# Altium schematic sheet Overview and Power.SchDoc
size A; SheetNumber: 1; SheetTotal: 9
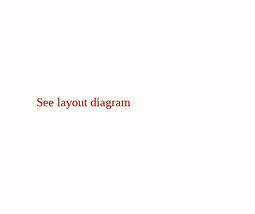
[diagram p0: Overview and Power.SchDoc, left]
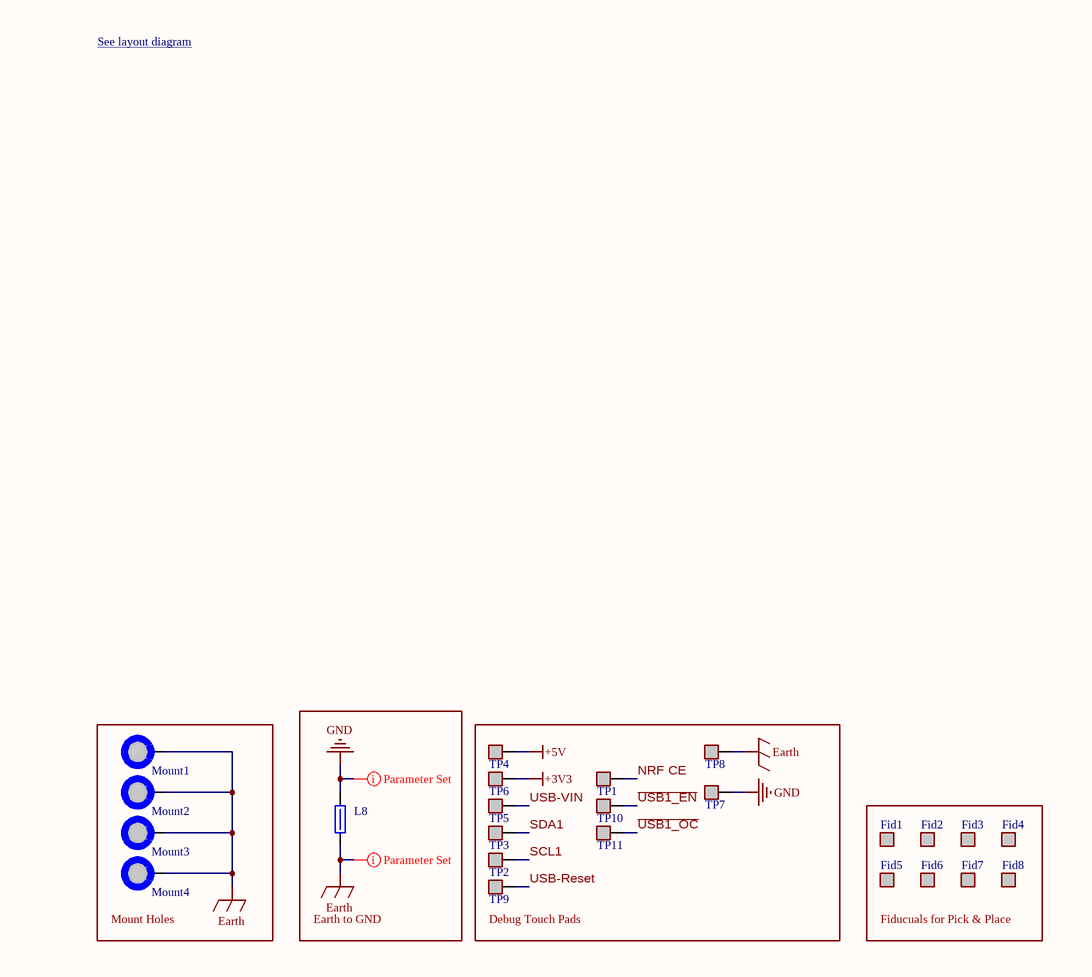
[diagram p1: Overview and Power.SchDoc, right]

## Parts
Fid1  JLCPCB Pick & Place Fiducial  [[Fiducial] JLCPCB Pick & Place]  (value not drawn)  (no BOM)
Fid2  JLCPCB Pick & Place Fiducial  [[Fiducial] JLCPCB Pick & Place]  (value not drawn)  (no BOM)
Fid3  JLCPCB Pick & Place Fiducial  [[Fiducial] JLCPCB Pick & Place]  (value not drawn)  (no BOM)
Fid4  JLCPCB Pick & Place Fiducial  [[Fiducial] JLCPCB Pick & Place]  (value not drawn)  (no BOM)
Fid5  JLCPCB Pick & Place Fiducial  [[Fiducial] JLCPCB Pick & Place]  (value not drawn)  (no BOM)
Fid6  JLCPCB Pick & Place Fiducial  [[Fiducial] JLCPCB Pick & Place]  (value not drawn)  (no BOM)
Fid7  JLCPCB Pick & Place Fiducial  [[Fiducial] JLCPCB Pick & Place]  (value not drawn)  (no BOM)
Fid8  JLCPCB Pick & Place Fiducial  [[Fiducial] JLCPCB Pick & Place]  (value not drawn)  (no BOM)
L8  742792040  [[Ferrite] SMD Bead 0805 (2)]  (value not drawn)
Mount1  M3 Mount Hole  [[Mount] M3 Mount Hole]  (value not drawn)  (no BOM)
Mount2  M3 Mount Hole  [[Mount] M3 Mount Hole]  (value not drawn)  (no BOM)
Mount3  M3 Mount Hole  [[Mount] M3 Mount Hole]  (value not drawn)  (no BOM)
Mount4  M3 Mount Hole  [[Mount] M3 Mount Hole]  (value not drawn)  (no BOM)
TP1  Probe Pad  [[Probe] Touch Pad]  (value not drawn)  (no BOM)
TP2  Probe Pad  [[Probe] Touch Pad]  (value not drawn)  (no BOM)
TP3  Probe Pad  [[Probe] Touch Pad]  (value not drawn)  (no BOM)
TP4  Probe Pad  [[Probe] Touch Pad]  (value not drawn)  (no BOM)
TP5  Probe Pad  [[Probe] Touch Pad]  (value not drawn)  (no BOM)
TP6  Probe Pad  [[Probe] Touch Pad]  (value not drawn)  (no BOM)
TP7  Probe Pad  [[Probe] Touch Pad]  (value not drawn)  (no BOM)
TP8  Probe Pad  [[Probe] Touch Pad]  (value not drawn)  (no BOM)
TP9  Probe Pad  [[Probe] Touch Pad]  (value not drawn)  (no BOM)
TP10  Probe Pad  [[Probe] Touch Pad]  (value not drawn)  (no BOM)
TP11  Probe Pad  [[Probe] Touch Pad]  (value not drawn)  (no BOM)

## Blocks framed on the sheet
Mount Holes: Mount1-Mount4
Earth to GND: L8
Debug Touch Pads: TP1-TP11
Fiducuals for Pick & Place: Fid1-Fid8

## Nets
+3V3: TP6.1
+5V: TP4.1
Earth: L8.1 Mount1.1 Mount2.1 Mount3.1 Mount4.1 TP8.1
GND: L8.2 TP7.1
~{USB1_EN}: TP10.1
~{USB1_OC}: TP11.1
NRF CE: TP1.1
SCL1: TP2.1
SDA1: TP3.1
USB-Reset: TP9.1
USB-VIN: TP5.1

## Layout directives
net class Supply_Nets: Earth, GND

## Notes on the sheet
- See layout diagram <https://drive.google.com/file/d/1B1LZ2g49TOjqrB7c7O0v-CyvsEDjMjX-/view?usp=drive_link>
- See layout diagram

## Library data of the parts
Fid1-Fid8 = [Fiducial] JLCPCB Pick & Place
L8 = [Ferrite] SMD Ferrite Bead (2): Supplier 1: DigiKey; Supplier Part Number 1: 732-1620-1-ND
Mount1-Mount4 = [Mount] M3 Mount Hole: Place at least 4.5mm from board edge. Plated.
TP1-TP11 = [Probe] Touch Pad